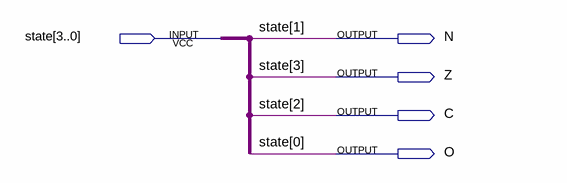
[diagram p0: schematic sheet]
// Quartus schematic state_debus.bdf as structural Verilog: 0 symbols, 5 pins
module state_debus (
  input  [3:0] state,
  output N,
  output Z,
  output C,
  output O
);


  assign C = state[2];
  assign N = state[1];
  assign O = state[0];
  assign Z = state[3];
endmodule
